# EAGLE design G1EXT_P3Adpt (EAGLE 9.7.0)
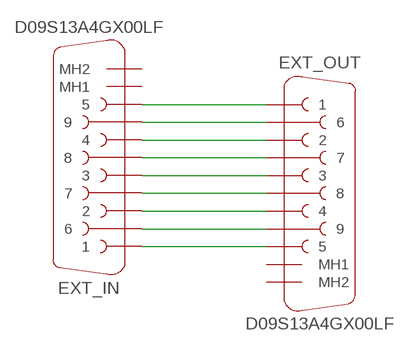
[diagram p0: schematic, sheet 1]

## Parts
EXT_IN  D09S13A4GX00LF  [D09S13A4GX00LF]
EXT_OUT  D09S13A4GX00LF  [D09S13A4GX00LF]

## Nets
N$1: EXT_IN.1 EXT_OUT.5
N$2: EXT_IN.5 EXT_OUT.1
N$3: EXT_IN.2 EXT_OUT.4
N$4: EXT_IN.4 EXT_OUT.2
N$5: EXT_IN.3 EXT_OUT.3
N$6: EXT_IN.6 EXT_OUT.9
N$7: EXT_IN.9 EXT_OUT.6
N$8: EXT_IN.7 EXT_OUT.8
N$9: EXT_IN.8 EXT_OUT.7
Unconnected: EXT_IN.MH1(MH2) EXT_IN.MH2(MH1) EXT_OUT.MH1(MH2) EXT_OUT.MH2(MH1)

## Library data of the parts
EXT_IN EXT_OUT = Connector_D-Sub:D09S13A4GX00LF: D-SUB-9POS-RCPT-R/A SLDR Reference: Datasheet <https://cdn.amphenol-icc.com/media/wysiwyg/files/documentation/datasheet/inputoutput/io_dsub_d8656.pdf> & Drawing <https://cdn.amphenol-icc.com/media/wysiwyg/files/drawing/c01-8646-0294.pdf>

## Board
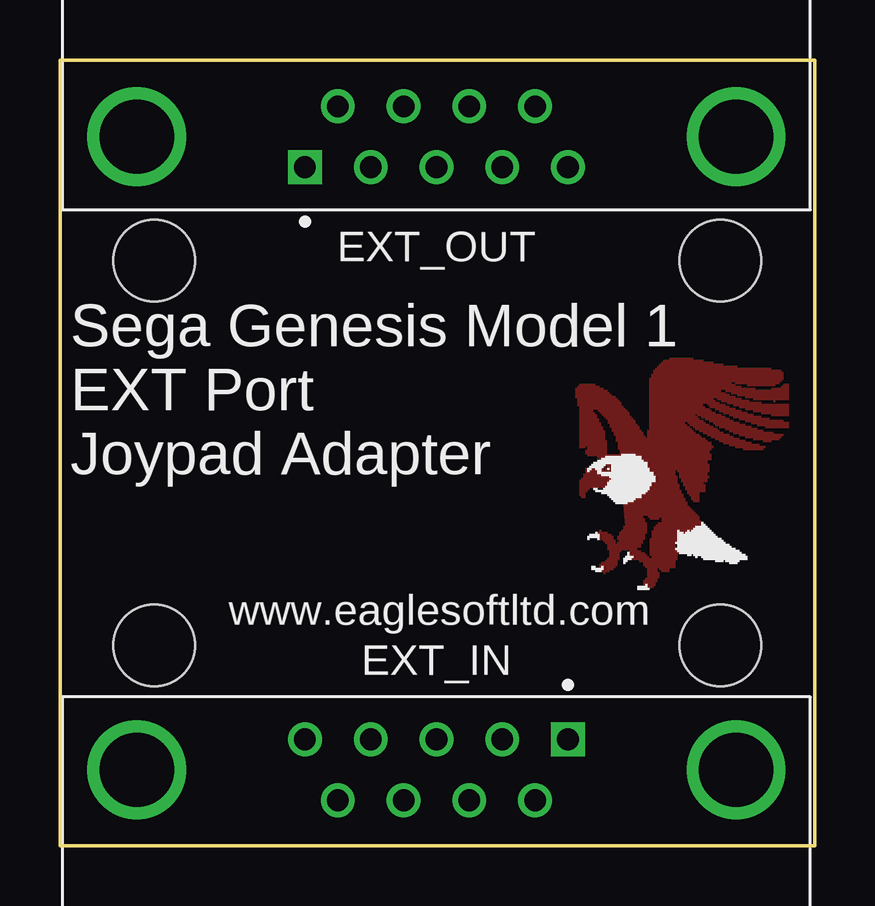
[diagram p1: board, top side]
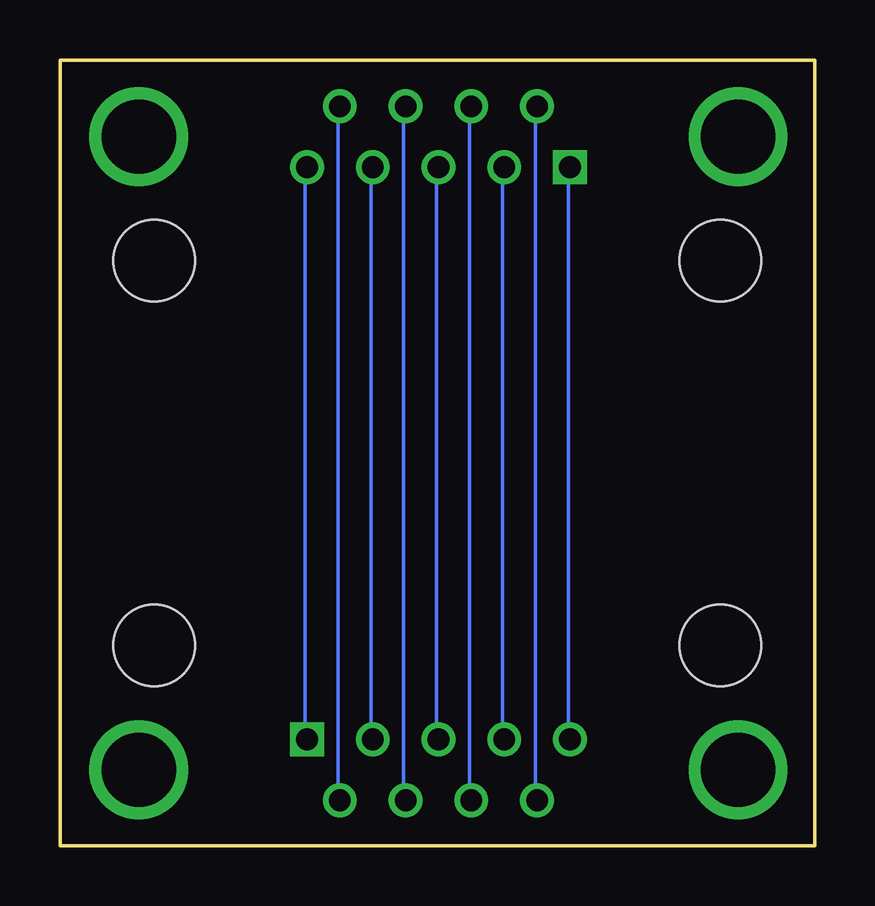
[diagram p2: board, bottom side, seen from below]

Size 31.48 x 32.77 mm. Coordinates in mm from the lower left corner, seen from the top.
Outline: 0,32.77 31.48,32.77 31.48,0 0,0 0,32.77
Copper layers (1*16): Top / Bottom
Stack-up Default Layer Stack: Top SilkScreen Epoxy Ink / Top SolderMask SR:Green 0.0254mm Dk 4.3 / Top Surface Finish Lead-Free 0.02mm / Top CuFoil:007 0.035mm / Dielectric-1 User Defined 1.5mm / Bottom CuFoil:007 0.035mm / Bottom Surface Finish Lead-Free 0.02mm / Bottom SolderMask SR:Green 0.0254mm Dk 4.3 / Bottom SilkScreen Epoxy Ink
Design rules: minimum copper width 6mil, minimum drill size 0.35mm, copper clearance wire_polygon to wire_polygon 6mil, copper clearance wire_polygon to pad_smd 6mil, copper clearance wire_polygon to via 6mil, copper clearance pad_smd to pad_smd 6mil, copper clearance pad_smd to via 6mil, copper clearance via to via 6mil, copper clearance smd to pad (same net) 6mil, copper clearance smd to via (same net) 6mil, copper clearance smd to smd (same net) 6mil, dimension clearance 40mil, via restrict clearance 0mil, restrict clearance 0mil, drill distance 6mil, keepout clearance 0mil
Holes 3.4 mm at 3.94,24.41 3.93,8.37 27.54,8.37 27.54,24.4

### Footprints (pad centres in the part's own frame; a part is rotated, then mirrored left to right if it is on the bottom)
D09S13A4GX00LF = drill 0.9 square: 1 5.48,8.76 | drill 0.9: 2 2.74,8.76; 3 0,8.76; 4 -2.74,8.76; 5 -5.48,8.76; 6 4.11,6.22; 7 1.37,6.22; 8 -1.37,6.22; 9 -4.11,6.22 | drill 3.1: MH1 -12.495,7.49; MH2 12.495,7.49

### Placement (x,y rotation side)
EXT_IN  15.7,-4.32 0 top
EXT_OUT  15.7,37.06 180 top

### Tracks (layer width: path | path; a pad name or v marks a point on that pad's centre or on a via)
N$1
  Bottom 0.152: EXT_IN.1 21.26,4.57 21.26,28.19 EXT_OUT.5
N$2
  Bottom 0.152: EXT_IN.5 10.29,4.57 10.29,28.19 EXT_OUT.1
N$3
  Bottom 0.152: EXT_IN.2 18.52,4.57 18.52,28.19 EXT_OUT.4
N$4
  Bottom 0.152: EXT_IN.4 13.03,4.57 13.03,28.19 EXT_OUT.2
N$5
  Bottom 0.152: EXT_IN.3 15.77,4.57 15.77,28.19 EXT_OUT.3
N$6
  Bottom 0.152: EXT_IN.6 19.89,1.98 19.89,30.79 EXT_OUT.9
N$7
  Bottom 0.152: EXT_IN.9 11.66,1.98 11.66,30.79 EXT_OUT.6
N$8
  Bottom 0.152: EXT_IN.7 17.14,1.98 17.14,30.79 EXT_OUT.8
N$9
  Bottom 0.152: EXT_IN.8 14.4,1.98 14.4,30.79 EXT_OUT.7
N$10
  pour Top (no thermals): 615 corners
N$11
  pour Top (no thermals): 22.73,15.84 22.73,15.92 22.98,15.92 22.98,15.58 22.57,15.58 22.57,15.75 22.65,15.75 22.65,15.67 22.73,15.67 22.73,15.75 22.82,15.75 22.82,15.67 22.9,15.67 22.9,15.75 22.82,15.75 22.82,15.84
  pour Top (no thermals): 22.65,15.84 22.65,15.75 22.73,15.75 22.73,15.84
  pour Top (no thermals): 21.65,15.25 21.74,15.25 21.74,15.34 21.82,15.34 21.82,15.5 21.9,15.5 21.9,15.75 21.98,15.75 21.98,15.59 22.07,15.59 22.07,15.67 22.15,15.67 22.15,15.75 22.32,15.75 22.32,15.67 22.4,15.67 22.4,15.5 22.57,15.5 22.57,15.42 22.9,15.42 22.9,15.34 22.99,15.34 22.99,15.25 22.9,15.25 22.9,15.17 22.82,15.17 22.82,15.01 22.73,15.01 22.73,14.92 22.4,14.92 22.07,14.92 22.07,14.83 21.98,14.83 21.98,14.75 21.9,14.75 21.9,14.5 21.74,14.5 21.74,14.59 21.65,14.59 21.65,15.25
(copper drawn outside any net)
  shapes: Top area x9

### Text on the board
NamesTop: Sega Genesis Model 1 / EXT Port / Joypad Adapter | www.eaglesoftltd.com